# Altium schematic sheet MOSFET_BANK.SchDoc
size C; SheetNumber: 1; SheetTotal: 4
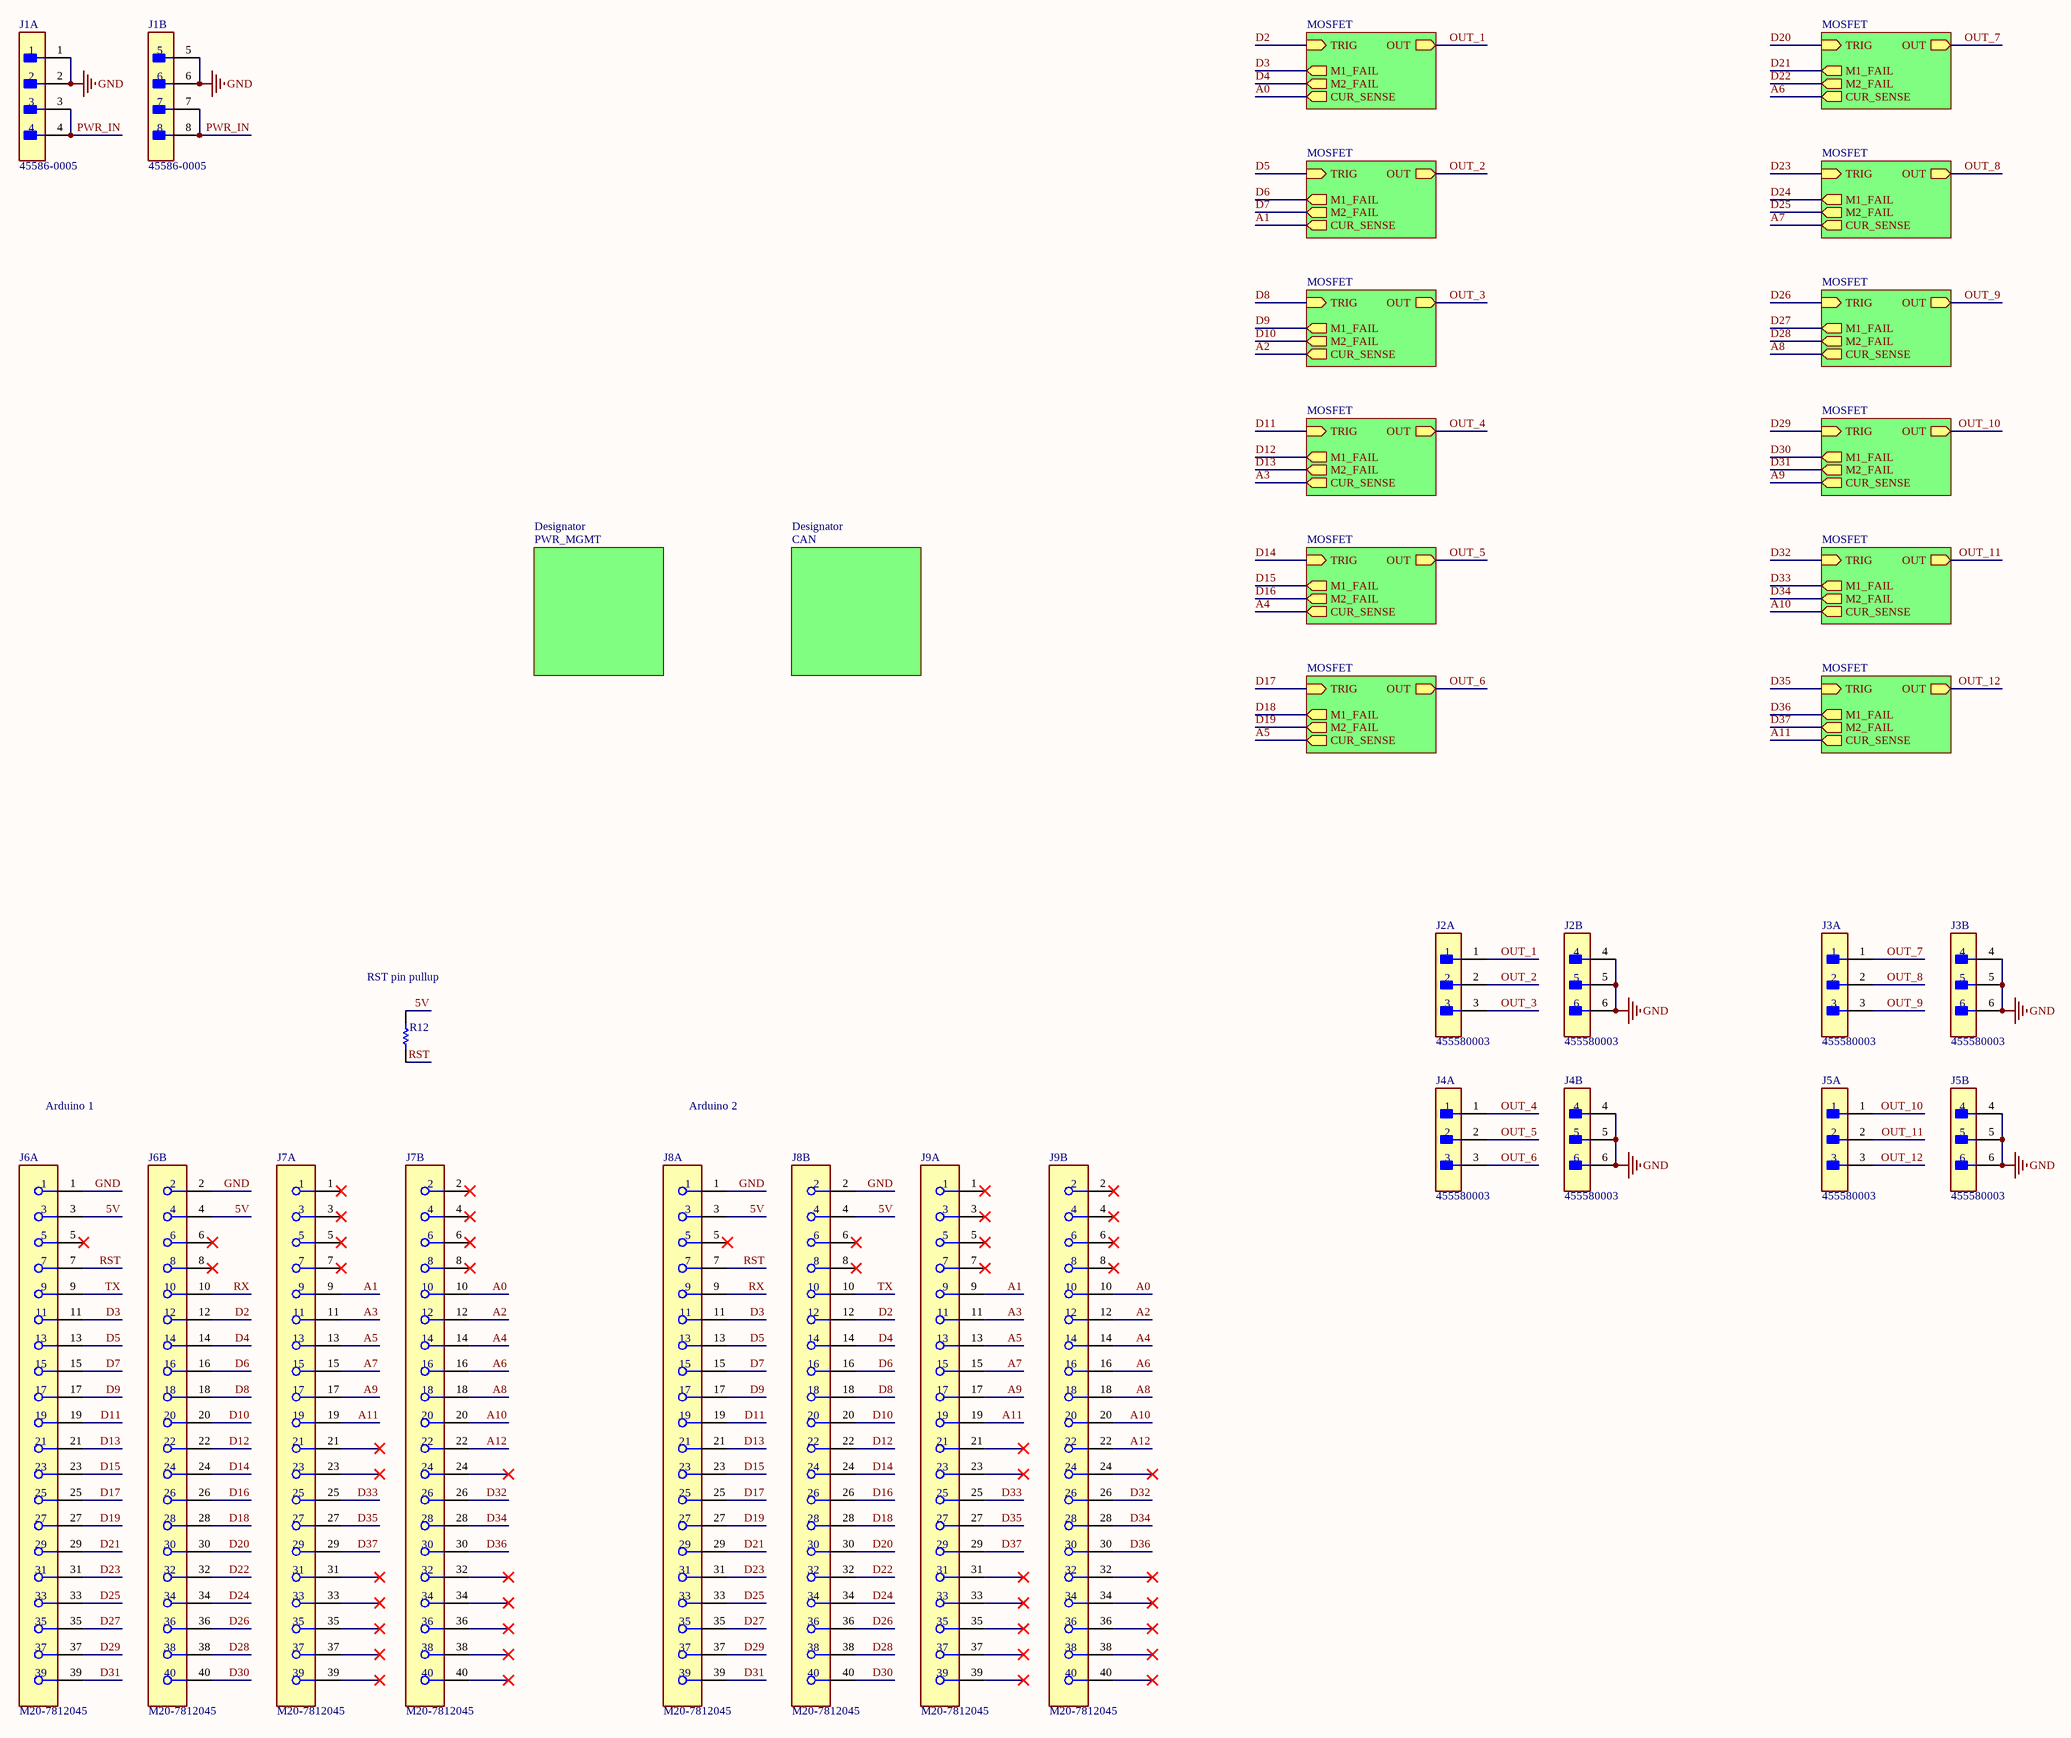
[diagram p0: MOSFET_BANK.SchDoc]

## Parts
J1  45586-0005  [FP-45586-0005-MFG]  (parts A,B of 2)
J2  455580003  [FP-455580003-MFG]  (parts A,B of 2)
J3  455580003  [FP-455580003-MFG]  (parts A,B of 2)
J4  455580003  [FP-455580003-MFG]  (parts A,B of 2)
J5  455580003  [FP-455580003-MFG]  (parts A,B of 2)
J6  M20-7812045  [FP-M20-7812045-MFG]  (parts A,B of 2)
J7  M20-7812045  [FP-M20-7812045-MFG]  (parts A,B of 2)
J8  M20-7812045  [FP-M20-7812045-MFG]  (parts A,B of 2)
J9  M20-7812045  [FP-M20-7812045-MFG]  (parts A,B of 2)
R12  ERJ3EKF1002V  [RESC1609X55X30LL15T15]  (value not drawn)

## Sub-sheets
Designator = CAN: no entries
Designator = PWR_MGMT: no entries
M? = MOSFET: TRIG (in), OUT (out), M2_FAIL (out), M1_FAIL (out), CUR_SENSE (out)
M? = MOSFET: TRIG (in), OUT (out), M2_FAIL (out), M1_FAIL (out), CUR_SENSE (out)
M? = MOSFET: TRIG (in), OUT (out), M2_FAIL (out), M1_FAIL (out), CUR_SENSE (out)
M? = MOSFET: TRIG (in), OUT (out), M2_FAIL (out), M1_FAIL (out), CUR_SENSE (out)
M? = MOSFET: TRIG (in), OUT (out), M2_FAIL (out), M1_FAIL (out), CUR_SENSE (out)
M? = MOSFET: TRIG (in), OUT (out), M2_FAIL (out), M1_FAIL (out), CUR_SENSE (out)
M? = MOSFET: TRIG (in), OUT (out), M2_FAIL (out), M1_FAIL (out), CUR_SENSE (out)
M? = MOSFET: TRIG (in), OUT (out), M2_FAIL (out), M1_FAIL (out), CUR_SENSE (out)
M? = MOSFET: TRIG (in), OUT (out), M2_FAIL (out), M1_FAIL (out), CUR_SENSE (out)
M? = MOSFET: TRIG (in), OUT (out), M2_FAIL (out), M1_FAIL (out), CUR_SENSE (out)
M? = MOSFET: TRIG (in), OUT (out), M2_FAIL (out), M1_FAIL (out), CUR_SENSE (out)
M? = MOSFET: TRIG (in), OUT (out), M2_FAIL (out), M1_FAIL (out), CUR_SENSE (out)

## Nets
GND: J1.1 J1.2 J1.5 J1.6 J2.4 J2.5 J2.6 J3.4 J3.5 J3.6 J4.4 J4.5 J4.6 J5.4 J5.5 J5.6 J6.1 J6.2 J8.1 J8.2
5V: J6.3 J6.4 J8.3 J8.4 R12.2
A0: J7.10 J9.10 ; sheet M?/CUR_SENSE
A1: J7.9 J9.9 ; sheet M?/CUR_SENSE
A2: J7.12 J9.12 ; sheet M?/CUR_SENSE
A3: J7.11 J9.11 ; sheet M?/CUR_SENSE
A4: J7.14 J9.14 ; sheet M?/CUR_SENSE
A5: J7.13 J9.13 ; sheet M?/CUR_SENSE
A6: J7.16 J9.16 ; sheet M?/CUR_SENSE
A7: J7.15 J9.15 ; sheet M?/CUR_SENSE
A8: J7.18 J9.18 ; sheet M?/CUR_SENSE
A9: J7.17 J9.17 ; sheet M?/CUR_SENSE
A10: J7.20 J9.20 ; sheet M?/CUR_SENSE
A11: J7.19 J9.19 ; sheet M?/CUR_SENSE
A12: J7.22 J9.22
D2: J6.12 J8.12 ; sheet M?/TRIG
D3: J6.11 J8.11 ; sheet M?/M1_FAIL
D4: J6.14 J8.14 ; sheet M?/M2_FAIL
D5: J6.13 J8.13 ; sheet M?/TRIG
D6: J6.16 J8.16 ; sheet M?/M1_FAIL
D7: J6.15 J8.15 ; sheet M?/M2_FAIL
D8: J6.18 J8.18 ; sheet M?/TRIG
D9: J6.17 J8.17 ; sheet M?/M1_FAIL
D10: J6.20 J8.20 ; sheet M?/M2_FAIL
D11: J6.19 J8.19 ; sheet M?/TRIG
D12: J6.22 J8.22 ; sheet M?/M1_FAIL
D13: J6.21 J8.21 ; sheet M?/M2_FAIL
D14: J6.24 J8.24 ; sheet M?/TRIG
D15: J6.23 J8.23 ; sheet M?/M1_FAIL
D16: J6.26 J8.26 ; sheet M?/M2_FAIL
D17: J6.25 J8.25 ; sheet M?/TRIG
D18: J6.28 J8.28 ; sheet M?/M1_FAIL
D19: J6.27 J8.27 ; sheet M?/M2_FAIL
D20: J6.30 J8.30 ; sheet M?/TRIG
D21: J6.29 J8.29 ; sheet M?/M1_FAIL
D22: J6.32 J8.32 ; sheet M?/M2_FAIL
D23: J6.31 J8.31 ; sheet M?/TRIG
D24: J6.34 J8.34 ; sheet M?/M1_FAIL
D25: J6.33 J8.33 ; sheet M?/M2_FAIL
D26: J6.36 J8.36 ; sheet M?/TRIG
D27: J6.35 J8.35 ; sheet M?/M1_FAIL
D28: J6.38 J8.38 ; sheet M?/M2_FAIL
D29: J6.37 J8.37 ; sheet M?/TRIG
D30: J6.40 J8.40 ; sheet M?/M1_FAIL
D31: J6.39 J8.39 ; sheet M?/M2_FAIL
D32: J7.26 J9.26 ; sheet M?/TRIG
D33: J7.25 J9.25 ; sheet M?/M1_FAIL
D34: J7.28 J9.28 ; sheet M?/M2_FAIL
D35: J7.27 J9.27 ; sheet M?/TRIG
D36: J7.30 J9.30 ; sheet M?/M1_FAIL
D37: J7.29 J9.29 ; sheet M?/M2_FAIL
OUT_1: J2.1 ; sheet M?/OUT
OUT_2: J2.2 ; sheet M?/OUT
OUT_3: J2.3 ; sheet M?/OUT
OUT_4: J4.1 ; sheet M?/OUT
OUT_5: J4.2 ; sheet M?/OUT
OUT_6: J4.3 ; sheet M?/OUT
OUT_7: J3.1 ; sheet M?/OUT
OUT_8: J3.2 ; sheet M?/OUT
OUT_9: J3.3 ; sheet M?/OUT
OUT_10: J5.1 ; sheet M?/OUT
OUT_11: J5.2 ; sheet M?/OUT
OUT_12: J5.3 ; sheet M?/OUT
PWR_IN: J1.3 J1.4 J1.7 J1.8
RST: J6.7 J8.7 R12.1
RX: J6.10 J8.9
TX: J6.9 J8.10

Not connected (* = marked no-connect by the designer): J6 5* 6* 8*; J7 1* 2* 3* 4* 5* 6* 7* 8* 21* 23* 24* 31* 32* 33* 34* 35* 36* 37* 38* 39* 40*; J8 5* 6* 8*; J9 1* 2* 3* 4* 5* 6* 7* 8* 21* 23* 24* 31* 32* 33* 34* 35* 36* 37* 38* 39* 40*

## Notes on the sheet
- (near R12) RST pin pullup
- Arduino 1
- Arduino 2

## Library data of the parts
J1 = CMP-04776-000690-1: CONN HEADER R/A 8POS 4.2MM
J2-J5 = CMP-04776-000024-1: CONN HEADER R/A 6POS 4.2MM; Manufacturer: Molex; Standoff Height: 0.4mm; Conn Orientation: Right Angle; Number Of Contacts: 6; Conn Gender: Male; Voltage Rating: 600V; Current Rating: 8A; Footprint Url: https://www.molex.com/pdm_docs/sd/455580003_sd.pdf; Number Of Rows: 2; Lead Free: Yes; Digikey Description: CONN HEADER R/A 6POS 4.2MM; ComponentLink2URL: https://www.molex.com/webdocs/datasheets/pdf/en-us/0455580003_PCB_HEADERS.pdf; Octopart: https://octopart.com/45558-0003-molex-7672845; Package: 0; Device Class L3: unset; ComponentLink2Description: Datasheet; Device Class L2: Headers and Wire Housings; Category: Conn; Contact Material: Tin,Nickel; Mouser Description: Conn Power HDR 6 POS 4.2mm Solder ST Thru-Hole 6 Terminal 1 Port Mini-Fit Jr™ Tray; Manufacturer Part Number: 455580003; Pitch: 4.2mm; Device Class L1: Connectors; Temperature Range Low: -40°C; Temperature: -40°C to +105°C; RoHS: TRUE; Temperature Range High: +105°C; Height: 10.38mm; Automotive: No
J6-J9 = CMP-15831-000026-1: CONN RCPT 40POS 0.1 GOLD SMD; Current Rating: 3A; Number of Positions: 40; Connector Type: Receptacle; Max Operating Temperature: 105°C; Flammability Rating: UL94 V-0; Contact Material: Bronze; Number of Rows: 2; Fastening Type: Push; Insulation Color: Black; Mount: Surface Mount; Contact Shape: Square; Termination: Solder; Packaging: Rail/Tube; Contact Plating: Gold; Min Operating Temperature: -40°C; Insulation Material: Nylon
R12 = CMP-1012-00623-3: Chip Resistor, 10 KOhm, +/- 1%, 0.1 W, -55 to 155 degC, 0603 (1608 Metric), RoHS, Tape and Reel; Manufacturer: Panasonic; Voltage Rating: 75V; Case\/Package: 0603; Power Rating: 100mW; Resistance: 10KOhm; Temperature Coefficient: 100ppm\/degreesC; Number of Pins: 2; Package Reference: 603; Depth: 0.8mm; Mount: SurfaceMount; Package Description: 2-Pin Surface Mount Device, Body 1.6 x 0.85 mm; Datasheet Version: 02/2017; Length: 1.6mm; Lead Free: LeadFree; Height: 0.45mm; Number of Terminations: 2; Max Power Dissipation: 100mW; Min Operating Temperature: -55degC; Datasheet URL: https://industrial.panasonic.com/cdbs/www-data/pdf/RDA0000/AOA0000C304.pdf; Termination: SMD/SMT; Case Code (Metric): 1608; Case Code (Imperial): 0603; Tolerance: 1%; Max Operating Temperature: 155degC; RoHSCompliant: true; Voltage Rating (DC): 75V; Radiation Hardening: No; Packaging: TapeandReel; Composition: ThickFilm; Mounting Technology: SurfaceMount; Manufacturer URL: http://www.panasonic.com/; Width: 0.031inch; REACH SVHC: NoSVHC; Contact Plating: Tin; Military Standard: Not; Package Quantity: 1